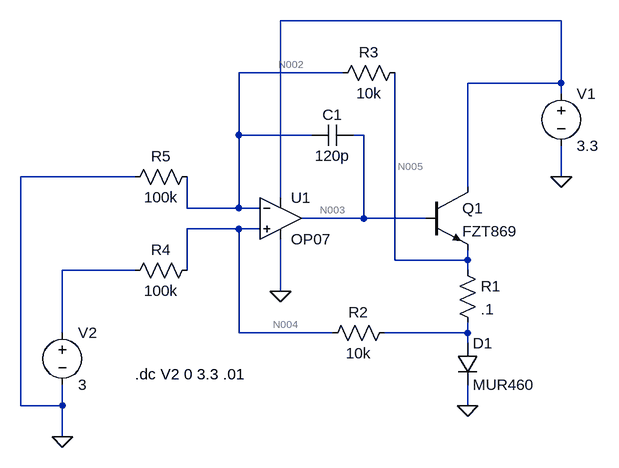
[diagram p0: schematic HPdriver_2.asc]
HPdriver_2.asc, the LTspice schematic file:
Version 4
SHEET 1 880 692
WIRE 624 -128 192 -128
WIRE 288 -48 128 -48
WIRE 624 -32 624 -128
WIRE 624 -32 480 -32
WIRE 624 -16 624 -32
WIRE 128 48 128 -48
WIRE 240 48 128 48
WIRE 320 48 304 48
WIRE -32 112 -208 112
WIRE 624 112 624 64
WIRE 480 128 480 -32
WIRE 192 144 192 -128
WIRE 48 160 48 112
WIRE 128 160 128 48
WIRE 128 160 48 160
WIRE 160 160 128 160
WIRE 320 176 320 48
WIRE 320 176 224 176
WIRE 416 176 320 176
WIRE 128 192 48 192
WIRE 160 192 128 192
WIRE 368 240 368 -48
WIRE 480 240 480 224
WIRE 480 240 368 240
WIRE -32 256 -144 256
WIRE 48 256 48 192
WIRE 480 256 480 240
WIRE 192 288 192 208
WIRE -144 352 -144 256
WIRE 128 352 128 192
WIRE 272 352 128 352
WIRE 480 352 480 336
WIRE 480 352 352 352
WIRE 480 368 480 352
WIRE -208 464 -208 112
WIRE -144 464 -144 432
WIRE -144 464 -208 464
WIRE 480 464 480 432
WIRE -144 512 -144 464
FLAG 192 288 0
FLAG 480 464 0
FLAG 624 112 0
FLAG -144 512 0
SYMBOL OpAmps\\OP07 192 112 R0
SYMATTR InstName U1
SYMBOL npn 416 128 R0
SYMATTR InstName Q1
SYMATTR Value FZT869
SYMBOL res 464 240 R0
SYMATTR InstName R1
SYMATTR Value .1
SYMBOL res 368 336 R90
WINDOW 0 0 56 VBottom 2
WINDOW 3 32 56 VTop 2
SYMATTR InstName R2
SYMATTR Value 10k
SYMBOL res 384 -64 R90
WINDOW 0 0 56 VBottom 2
WINDOW 3 32 56 VTop 2
SYMATTR InstName R3
SYMATTR Value 10k
SYMBOL res 64 240 R90
WINDOW 0 0 56 VBottom 2
WINDOW 3 32 56 VTop 2
SYMATTR InstName R4
SYMATTR Value 100k
SYMBOL res 64 96 R90
WINDOW 0 0 56 VBottom 2
WINDOW 3 32 56 VTop 2
SYMATTR InstName R5
SYMATTR Value 100k
SYMBOL voltage 624 -32 R0
WINDOW 123 0 0 Left 0
WINDOW 39 0 0 Left 0
SYMATTR InstName V1
SYMATTR Value 3.3
SYMBOL voltage -144 336 R0
WINDOW 123 0 0 Left 0
WINDOW 39 0 0 Left 0
SYMATTR InstName V2
SYMATTR Value 3
SYMBOL cap 304 32 R90
WINDOW 0 0 32 VBottom 2
WINDOW 3 32 32 VTop 2
SYMATTR InstName C1
SYMATTR Value 120p
SYMBOL diode 464 368 R0
SYMATTR InstName D1
SYMATTR Value MUR460
TEXT -32 416 Left 2 !.dc V2 0 3.3 .01

The netlist it stands for:
* HPdriver_2.asc
XU1 N004 N002 N001 0 N003 LT1001  ; OP07, pins In+ In- V+ V- OUT
Q1 N001 N003 N005 0 FZT869
R1 N005 N007 .1
R2 N007 N004 10k
R3 N005 N002 10k
R4 N004 N006 100k
R5 N002 0 100k
V1 N001 0 3.3
V2 N006 0 3
C1 N003 N002 120p
D1 N007 0 MUR460
.model D D
.lib standard.dio
.model NPN NPN
.model PNP PNP
.lib standard.bjt
.dc V2 0 3.3 .01
.lib LTC.lib
.backanno
.end

* Results of the author's LTspice run, read from the files saved beside the schematic
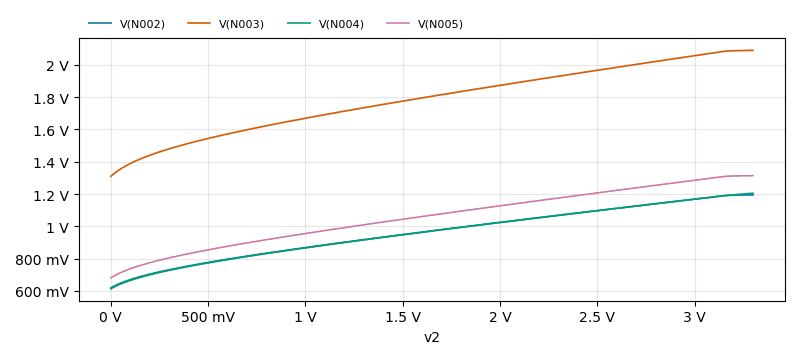
[diagram p1: DC transfer characteristic of HPdriver_2.asc, plotted from the saved traces]
* DC transfer characteristic, 1 run:
*   V(N002): 619.5 mV at v2=0 V, 1.195 V at v2=3.3 V, min 619.5 mV, max 1.195 V
*   V(N003): 1.31 V at v2=0 V, 2.089 V at v2=3.3 V, min 1.31 V, max 2.089 V
*   V(N004): 613.6 mV at v2=0 V, 1.205 V at v2=3.3 V, min 613.6 mV, max 1.205 V
*   V(N005): 681.5 mV at v2=0 V, 1.314 V at v2=3.3 V, min 681.5 mV, max 1.314 V